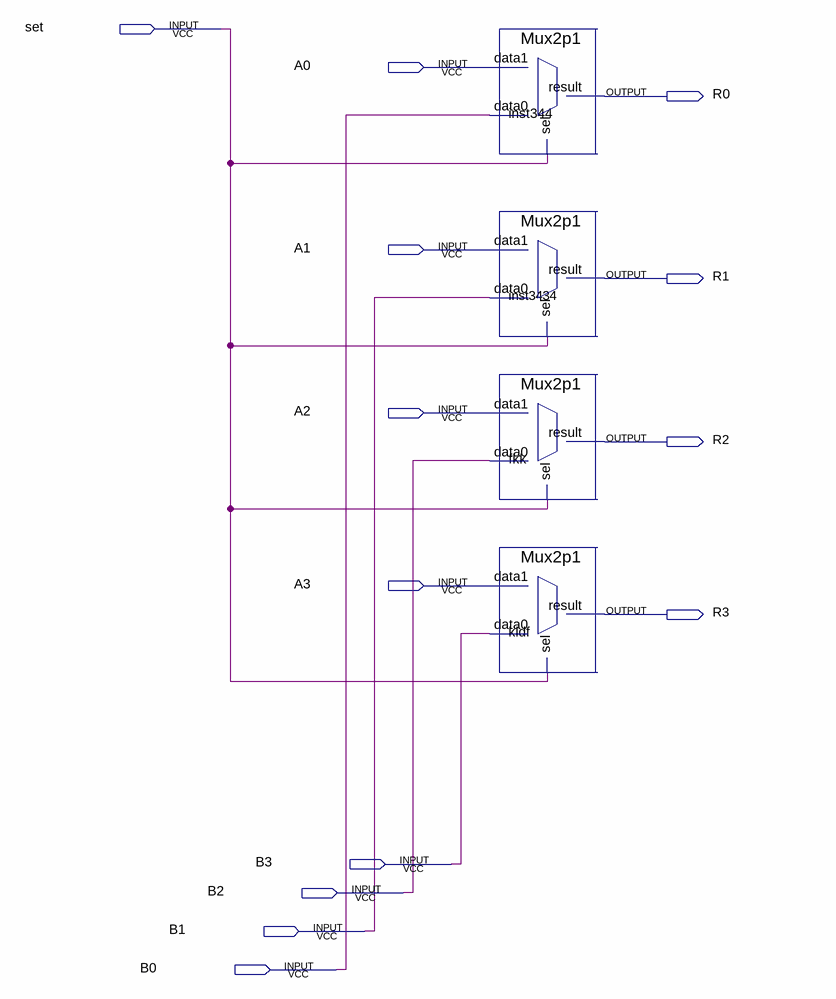
[diagram p0: schematic sheet]
// Quartus schematic seletor.bdf as structural Verilog: 4 symbols, 13 pins
module seletor (
  input  set,
  input  A0,
  input  A1,
  input  A2,
  input  A3,
  input  B3,
  input  B2,
  input  B1,
  input  B0,
  output R0,
  output R1,
  output R2,
  output R3
);

  Mux2p1 inst344 (.data1(A0), .data0(B0), .sel(set), .result(R0));
  Mux2p1 inst3434 (.data1(A1), .data0(B1), .sel(set), .result(R1));
  Mux2p1 fkk (.data1(A2), .data0(B2), .sel(set), .result(R2));
  Mux2p1 kldf (.data1(A3), .data0(B3), .sel(set), .result(R3));
endmodule
